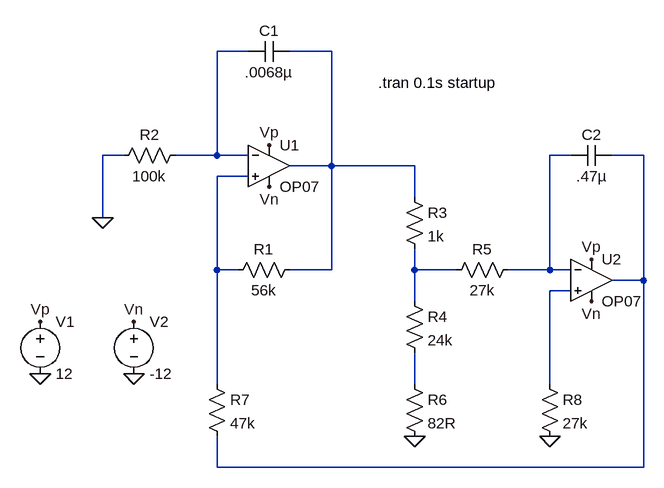
[diagram p0: schematic oscillator_fixed.asc]
oscillator_fixed.asc, the LTspice schematic file:
Version 4
SHEET 1 880 804
WIRE 112 16 64 16
WIRE 240 16 176 16
WIRE -80 176 -112 176
WIRE 64 176 64 16
WIRE 64 176 0 176
WIRE 112 176 64 176
WIRE 608 176 576 176
WIRE 720 176 672 176
WIRE 240 192 240 16
WIRE 240 192 176 192
WIRE 368 192 240 192
WIRE 112 208 64 208
WIRE 368 240 368 192
WIRE -112 272 -112 176
WIRE 64 352 64 208
WIRE 96 352 64 352
WIRE 240 352 240 192
WIRE 240 352 176 352
WIRE 368 352 368 320
WIRE 432 352 368 352
WIRE 576 352 576 176
WIRE 576 352 512 352
WIRE 608 352 576 352
WIRE 720 368 720 176
WIRE 720 368 672 368
WIRE 608 384 576 384
WIRE 368 400 368 352
WIRE 64 528 64 352
WIRE 368 528 368 480
WIRE 576 528 576 384
WIRE 64 656 64 608
WIRE 720 656 720 368
WIRE 720 656 64 656
FLAG -112 272 0
FLAG 368 608 0
FLAG 576 608 0
FLAG -208 432 Vp
FLAG 144 160 Vp
FLAG 640 336 Vp
FLAG -64 432 Vn
FLAG 144 224 Vn
FLAG 640 400 Vn
FLAG -64 512 0
FLAG -208 512 0
SYMBOL Opamps\\OP07 144 128 R0
SYMATTR InstName U1
SYMBOL cap 176 0 R90
WINDOW 0 0 32 VBottom 2
WINDOW 3 32 32 VTop 2
SYMATTR InstName C1
SYMATTR Value .0068µ
SYMBOL res 192 336 R90
WINDOW 0 0 56 VBottom 2
WINDOW 3 32 56 VTop 2
SYMATTR InstName R1
SYMATTR Value 56k
SYMBOL res 16 160 R90
WINDOW 0 0 56 VBottom 2
WINDOW 3 32 56 VTop 2
SYMATTR InstName R2
SYMATTR Value 100k
SYMBOL res 352 224 R0
SYMATTR InstName R3
SYMATTR Value 1k
SYMBOL res 352 384 R0
SYMATTR InstName R4
SYMATTR Value 24k
SYMBOL res 528 336 R90
WINDOW 0 0 56 VBottom 2
WINDOW 3 32 56 VTop 2
SYMATTR InstName R5
SYMATTR Value 27k
SYMBOL res 352 512 R0
SYMATTR InstName R6
SYMATTR Value 82R
SYMBOL Opamps\\OP07 640 304 R0
SYMATTR InstName U2
SYMBOL cap 672 160 R90
WINDOW 0 0 32 VBottom 2
WINDOW 3 32 32 VTop 2
SYMATTR InstName C2
SYMATTR Value .47µ
SYMBOL res 48 512 R0
SYMATTR InstName R7
SYMATTR Value 47k
SYMBOL res 560 512 R0
SYMATTR InstName R8
SYMATTR Value 27k
SYMBOL voltage -208 416 R0
WINDOW 123 0 0 Left 0
WINDOW 39 0 0 Left 0
SYMATTR InstName V1
SYMATTR Value 12
SYMBOL voltage -64 416 R0
SYMATTR InstName V2
SYMATTR Value -12
TEXT 312 64 Left 2 !.tran 0.1s startup

The netlist it stands for:
* oscillator_fixed.asc
XU1 N005 N001 Vp Vn N002 LT1001  ; OP07, pins In+ In- V+ V- OUT
C1 N002 N001 .0068µ
R1 N002 N005 56k
R2 N001 0 100k
R3 N002 N006 1k
R4 N006 N008 24k
R5 N003 N006 27k
R6 N008 0 82R
XU2 N007 N003 Vp Vn N004 LT1001  ; OP07, pins In+ In- V+ V- OUT
C2 N004 N003 .47µ
R7 N005 N004 47k
R8 N007 0 27k
V1 Vp 0 12
V2 Vn 0 -12
.tran 0.1s startup
.lib LTC.lib
.backanno
.end